# EAGLE design minimote (EAGLE 8.7.1)
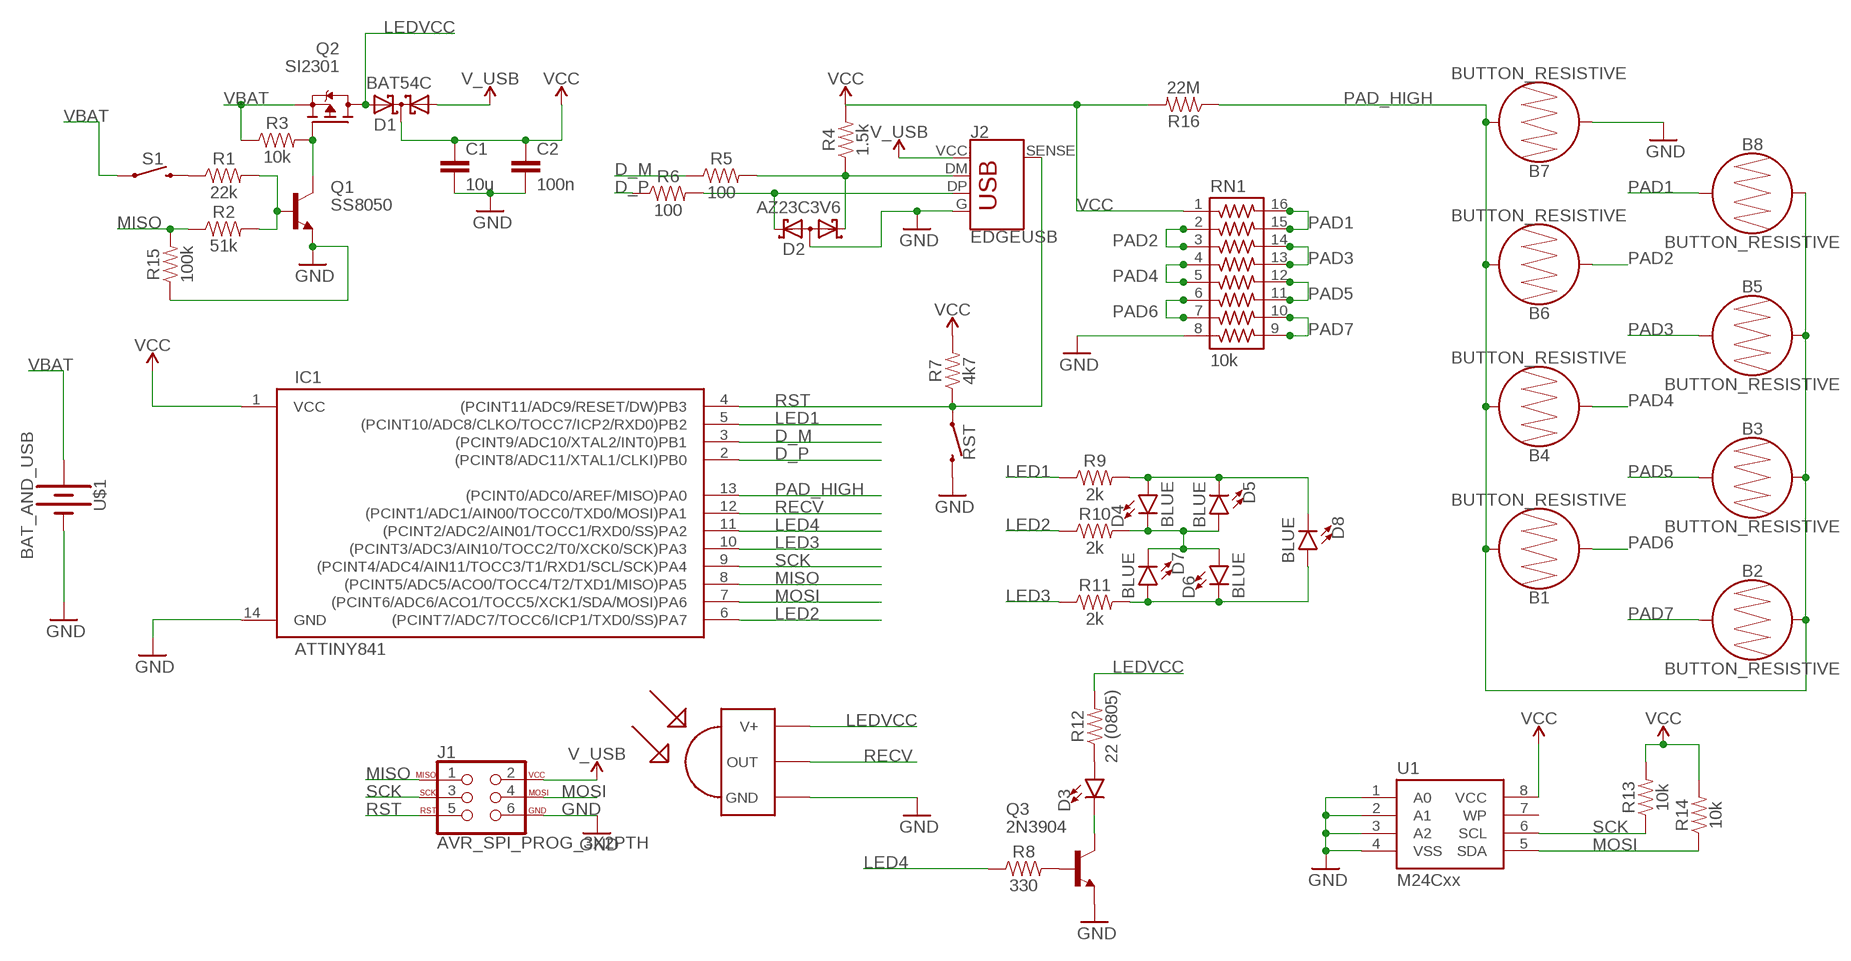
[diagram p0: schematic, sheet 1]

## Parts
B1  BUTTON_RESISTIVE  [BUTTON-CONDUCTIVE]
B2  BUTTON_RESISTIVE  [BUTTON-CONDUCTIVE]
B3  BUTTON_RESISTIVE  [BUTTON-CONDUCTIVE]
B4  BUTTON_RESISTIVE  [BUTTON-CONDUCTIVE]
B5  BUTTON_RESISTIVE  [BUTTON-CONDUCTIVE]
B6  BUTTON_RESISTIVE  [BUTTON-CONDUCTIVE]
B7  BUTTON_RESISTIVE  [BUTTON-CONDUCTIVE]
B8  BUTTON_RESISTIVE  [BUTTON-CONDUCTIVE]
C1  10u  10UF-0603-6.3V-20%  [0603]
C2  100n  10UF-0603-6.3V-20%  [0603]
D1  BAT54C  [SOT23]
D2  AZ23C3V6  [SOT23]
D3  LED3MM  [LED_3MM]
D4  BLUE  LED-BLUE0603  [LED-0603]
D5  BLUE  LED-BLUE0603  [LED-0603]
D6  BLUE  LED-BLUE0603  [LED-0603]
D7  BLUE  LED-BLUE0603  [LED-0603]
D8  BLUE  LED-BLUE0603  [LED-0603]
IC1  ATTINY841  ATTINY441/841-SSU  [SOIC14N]
J1  AVR_SPI_PROG_3X2PTH  [2X3]
J2  EDGEUSB  [USBPCB]
Q1  SS8050  [SOT23]
Q2  SI2301  [SOT23]
Q3  2N3904  MMBT3904LT1-NPN-SOT23-BEC  [SOT23-BEC]
R1  22k  3.3KOHM-0603-1/10W-1%  [0603]
R2  51k  3.3KOHM-0603-1/10W-1%  [0603]
R3  10k  3.3KOHM-0603-1/10W-1%  [0603]
R4  1.5k  3.3KOHM-0603-1/10W-1%  [0603]
R5  100  3.3KOHM-0603-1/10W-1%  [0603]
R6  100  3.3KOHM-0603-1/10W-1%  [0603]
R7  4k7  3.3KOHM-0603-1/10W-1%  [0603]
R8  330  3.3KOHM-0603-1/10W-1%  [0603]
R9  2k  3.3KOHM-0603-1/10W-1%  [0603]
R10  2k  3.3KOHM-0603-1/10W-1%  [0603]
R11  2k  3.3KOHM-0603-1/10W-1%  [0603]
R12  22 (0805)  0.22OHM-0805-1/4W-1%  [0805]
R13  10k  3.3KOHM-0603-1/10W-1%  [0603]
R14  10k  3.3KOHM-0603-1/10W-1%  [0603]
R15  100k  3.3KOHM-0603-1/10W-1%  [0603]
R16  22M  3.3KOHM-0603-1/10W-1%  [0603]
RN1  10k  742-16NS  [742-16NS]
RST  MOMENTARY-SWITCH-SPST-SMD-5.2-REDUNDANT  [TACTILE_SWITCH_SMD_5.2MM]
S1  MOMENTARY-SWITCH-SPST-SMD-5.2-REDUNDANT  [TACTILE_SWITCH_SMD_5.2MM]
U1  M24Cxx  EEPROM-I2CEIAJ  [SO08-EIAJ]
U$1  BAT_AND_USB  [PUNCHOUT_USB]
U$2  TSOP1837  [TSOP18XX]

## Nets
D_M: IC1.3((PCINT9/ADC10/XTAL2/INT0)PB1) R5.1
D_P: IC1.2((PCINT8/ADC11/XTAL1/CLKI)PB0) R6.1
GND: B7.1 C1.2 C2.2 D2.3(AA) IC1.14(GND) J1.6 J2.G(GND) Q1.2(E) Q3.E R15.1 RN1.8 RST.3 RST.4 U1.1(A0) U1.2(A1) U1.3(A2) U1.4(VSS) U$1.B-(-) U$2.GND
LED1: IC1.5((PCINT10/ADC8/CLKO/TOCC7/ICP2/RXD0)PB2) R9.1
LED2: IC1.6((PCINT7/ADC7/TOCC6/ICP1/TXD0/SS)PA7) R10.1
LED3: IC1.10((PCINT3/ADC3/AIN10/TOCC2/T0/XCK0/SCK)PA3) R11.1
LED4: IC1.11((PCINT2/ADC2/AIN01/TOCC1/RXD0/SS)PA2) R8.1
LEDVCC: D1.2(A2) Q2.3(D) R12.2 U$2.VCC(V+)
MISO: IC1.8((PCINT5/ADC5/ACO0/TOCC4/T2/TXD1/MISO)PA5) J1.1 R2.1 R15.2
MOSI: IC1.7((PCINT6/ADC6/ACO1/TOCC5/XCK1/SDA/MOSI)PA6) J1.4 R14.1 U1.5(SDA)
N$1: D3.A R12.1
N$2: D3.K(C) Q3.C
N$3: Q3.B R8.2
N$4: Q1.3(C) Q2.1(G) R3.2
N$6: Q1.1(B) R1.2 R2.2
N$7: R1.1 S1.3 S1.4
N$8: D2.1(K2) J2.DP(D+) R6.2
N$9: D2.2(K1) J2.DM(D-) R4.1 R5.2
N$123: D6.C D7.A D8.A R11.2
N$124: D4.C D5.A D6.A D7.C R10.2
N$125: D4.A D5.C D8.C R9.2
PAD1: B8.1 RN1.15 RN1.16
PAD2: B6.1 RN1.2 RN1.3
PAD3: B5.1 RN1.13 RN1.14
PAD4: B4.1 RN1.4 RN1.5
PAD5: B3.1 RN1.11 RN1.12
PAD6: B1.1 RN1.6 RN1.7
PAD7: B2.1 RN1.9 RN1.10
PAD_HIGH: B1.2 B2.2 B3.2 B4.2 B5.2 B6.2 B7.2 B8.2 IC1.13((PCINT0/ADC0/AREF/MISO)PA0) R16.1
RECV: IC1.12((PCINT1/ADC1/AIN00/TOCC0/TXD0/MOSI)PA1) U$2.OUT
RST: IC1.4((PCINT11/ADC9/RESET/DW)PB3) J1.5 J2.SENSE R7.1 RST.1 RST.2
SCK: IC1.9((PCINT4/ADC4/AIN11/TOCC3/T1/RXD1/SCL/SCK)PA4) J1.3 R13.1 U1.6(SCL)
V_USB: D1.1(A1) J1.2 J2.VCC(VBUS)
VBAT: Q2.2(S) R3.1 S1.1 S1.2 U$1.B+(+)
VCC: C1.1 C2.1 D1.3(CC) IC1.1(VCC) R4.2 R7.2 R13.2 R14.2 R16.2 RN1.1 U1.8(VCC)
Unconnected: U1.7(WP)

## Library data of the parts
B1-B8 = minimote:BUTTON_RESISTIVE
C1 C2 = SparkFun-Capacitors:10UF: 10.0µF ceramic capacitors A capacitor is a passive two-terminal electrical component used to store electrical energy temporarily in an electric field.; PROD_ID: CAP-11015; VALUE: 10uF
D1 = diode:BAT54C: Schottky Diodes Source: Fairchild .. BAT54.pdf
D2 = minimote:AZ23C3V6
D3 = minimote:LED: LED (Generic) Standard schematic elements and footprints for 5mm, 3mm, 1206, and 0603 sized LEDs. Generic LEDs with no color specified.; PROD_ID: DIO-08794
D4-D8 = SparkFun-LED:LED-BLUE: Blue SMD LED Used in manufacturing of various products at SparkFun Packages: 0603 - SMD 0603 package [Product Link] <http://www.digikey.com/product-detail/en/SMLE12BC7TT86/511-1589-2-ND/1641808> 1206 - SMD1206 package [Product Link] <http://www.digikey.com/product-detail/en/lite-on-inc/LTST-C150TBKT/160-1643-1-ND/573584> SparkFun Products: ESP8266 Thing-Dev Board <https://www.sparkfun.com/products/13711> RedBoard <https://www.sparkfun.com/products/12757>; PROD_ID: DIO-08575
IC1 = bt_avr:ATTINY441/841: ATtiny441, ATtiny841 AVR Microcontroller The high-performance Atmel picoPower 8-bit AVR RISC-based microcontroller combines 4KB ISP flash memory, 512-Byte EEPROM, 128B SRAM, 12 general purpose I/O lines, 32 general purpose working registers, an 8-bit timer/counter with two PWM channels, two 16-bit timer/counters with two PWM channels, internal and external interrupts, an 12-channel 10-bit A/D converter, 2 On-chip analog comparators, 2 full duplex USARTs with Start Frame wake up from power down, master/slave SPI serial interface, slave I2C serial interface, programmable gain stage (1x, 20x, and 100x) for 12 differential ADC channel pairs, programmable watchdog timer with internal oscillator, internal calibrated oscillator, and four software selectable power saving modes. The device operates between 1.7-5.5 volts. datasheet.pdf <http://www.atmel.com/Images/Atmel-8495-8-bit-AVR-Microcontrollers-ATtiny441-ATtiny841_Datasheet.pdf>
J1 = minimote:AVR_SPI_PROG_3X2: AVR ISP 6 Pin This is the reduced ISP connector for AVR programming. Common on Arduino. This footprint will take up less PCB space and can be used with a 10-pin to 6-pin adapter such as SKU: BOB-08508 **Special note about "TEST_POINT" package. The stop mask is on the top side, so if you want your programming test points to be on the bottom of your board, make sure to place this package on the bottom side of the board. This also ensure that the orientation to program from the bottom side will be correct. SparkFun Products: SparkFun ISP Pogo Adapter <https://www.sparkfun.com/products/11591> - NS Tiny AVR Programmer <https://www.sparkfun.com/products/11801> -PTH
J2 = minimote:EDGEUSB
Q1 = minimote:SS8050
Q2 = minimote:SI2301
Q3 = transistor:*-NPN-: NPN Transistror BF959 corrected 2008.03.06
R1-R11 R13-R16 = SparkFun-Resistors:3.3KOHM: 3.3kΩ resistor A resistor is a passive two-terminal electrical component that implements electrical resistance as a circuit element. Resistors act to reduce current flow, and, at the same time, act to lower voltage levels within circuits. - Wikipedia; PROD_ID: RES-07851; VALUE: 3.3k
R12 = SparkFun-Resistors:0.22OHM: 0.22Ω resistor A resistor is a passive two-terminal electrical component that implements electrical resistance as a circuit element. Resistors act to reduce current flow, and, at the same time, act to lower voltage levels within circuits. - Wikipedia; PROD_ID: RES-09883; VALUE: 0.22
RN1 = resistor-array:742-16: CTS 742 Series 16 Terminations, 8 Resistors
RST S1 = SparkFun-Switches:MOMENTARY-SWITCH-SPST: Momentary Switch (Pushbutton) - SPST Normally-open (NO) SPST momentary switches (buttons, pushbuttons). Variants PTH-12MM - 12mm square, through-hole Momentary Pushbutton Switch - 12mm Square <https://www.sparkfun.com/products/9190> (COM-09190) PTH-6.0MM, PTH-6.0MM-KIT - 6.0mm square, through-hole Mini Pushbutton Switch <https://www.sparkfun.com/products/97> (COM-00097) KIT package intended for soldering kit's - only one side of pads' copper is exposed. PTH-RIGHT-ANGLE-KIT - Right-angle, through-hole Right Angle Tactile Button <https://www.sparkfun.com/products/10791> - Used on SparkFun BigTime Watch Kit <https://www.sparkfun.com/products/11734> SMD-12MM - 12mm square, surface-mount Tactile Button - SMD (12mm) <https://www.sparkfun.com/products/12993> (COM-12993) Used on SparkFun PicoBoard <https://www.sparkfun.com/products/11888> SMD-4.5MM - 4.5mm Square Trackball Switch Used on SparkFun Blackberry Trackballer Breakout <https://www.sparkfun.com/products/13169> SMD-4.6MMX2.8MM - 4.60mm x 2.80mm, surface mount Used on SparkFun SAMD21 Mini Breakout <https://www.sparkfun.com/products/13664> SMD-5.2MM, SMD-5.2-REDUNDANT - 5.2mm square, surface-mount Mini Pushbutton Switch - SMD <https://www.sparkfun.com/products/8720> (COM-08720) Used on Arduino Pro Mini <https://www.sparkfun.com/products/11114> REDUNDANT package connects both switch circuits together SMD-6.0X3.5MM - 6.0 x 3.5mm, surface mount Momentary Reset Switch SMD <https://www.sparkfun.com/products/8229> (COM-08229) SMD-6.2MM-TALL - 6.2mm square, surface mount Tactile Button - SMD (6mm) <https://www.sparkfun.com/products/12992> Used on SparkFun Digital Sandbox <https://www.sparkfun.com/products/12651> SMD-RIGHT-ANGLE - Right-angle, surface mount Used on SparkFun Block for Intel® Edison - Arduino <https://www.sparkfun.com/products/13036>; PROD_ID: SWCH-08247; SF_SKU: COM-08720
U1 = SparkFun-IC-Memory:EEPROM-I2C: I2C EEPROMs, 24LC256 and others 24LC256 Series 256 kb I2C 2 Wire (32 k x 8 Bit) 2.5 V Serial EEPROM SMD - SOIC-8 Datasheet SparkFun Products SparkFun UDB5 - PIC UAV Development Board <https://www.sparkfun.com/products/11703> (GPS-11703); PROD_ID: NA-XXXXX; VALUE: I2C EEPROM
U$1 = minimote:BAT_AND_USB
U$2 = tsop:TSOP1837: IR Receiver and Demodulator

## Board
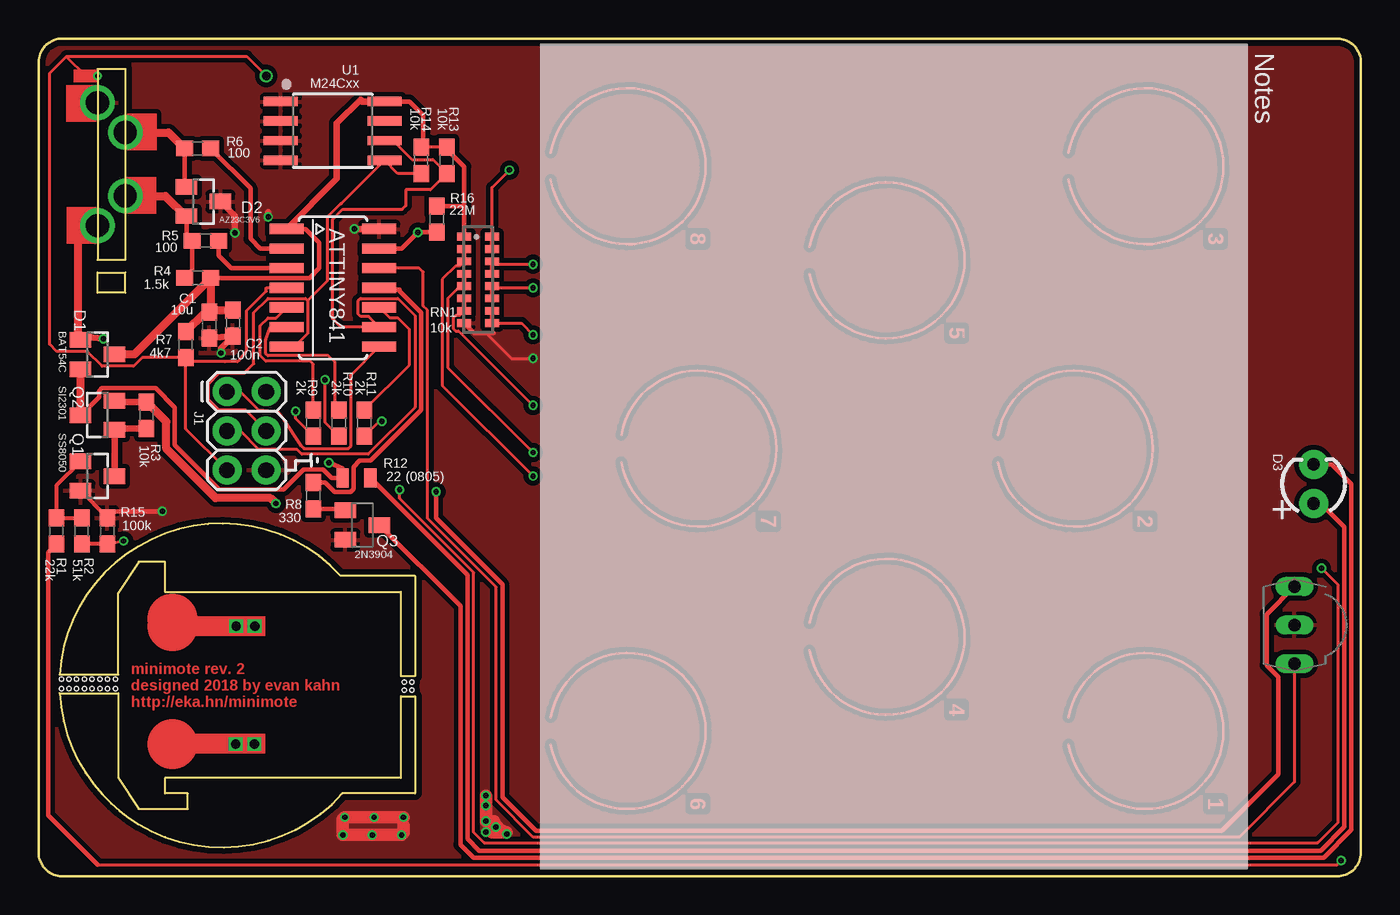
[diagram p1: board, top side]
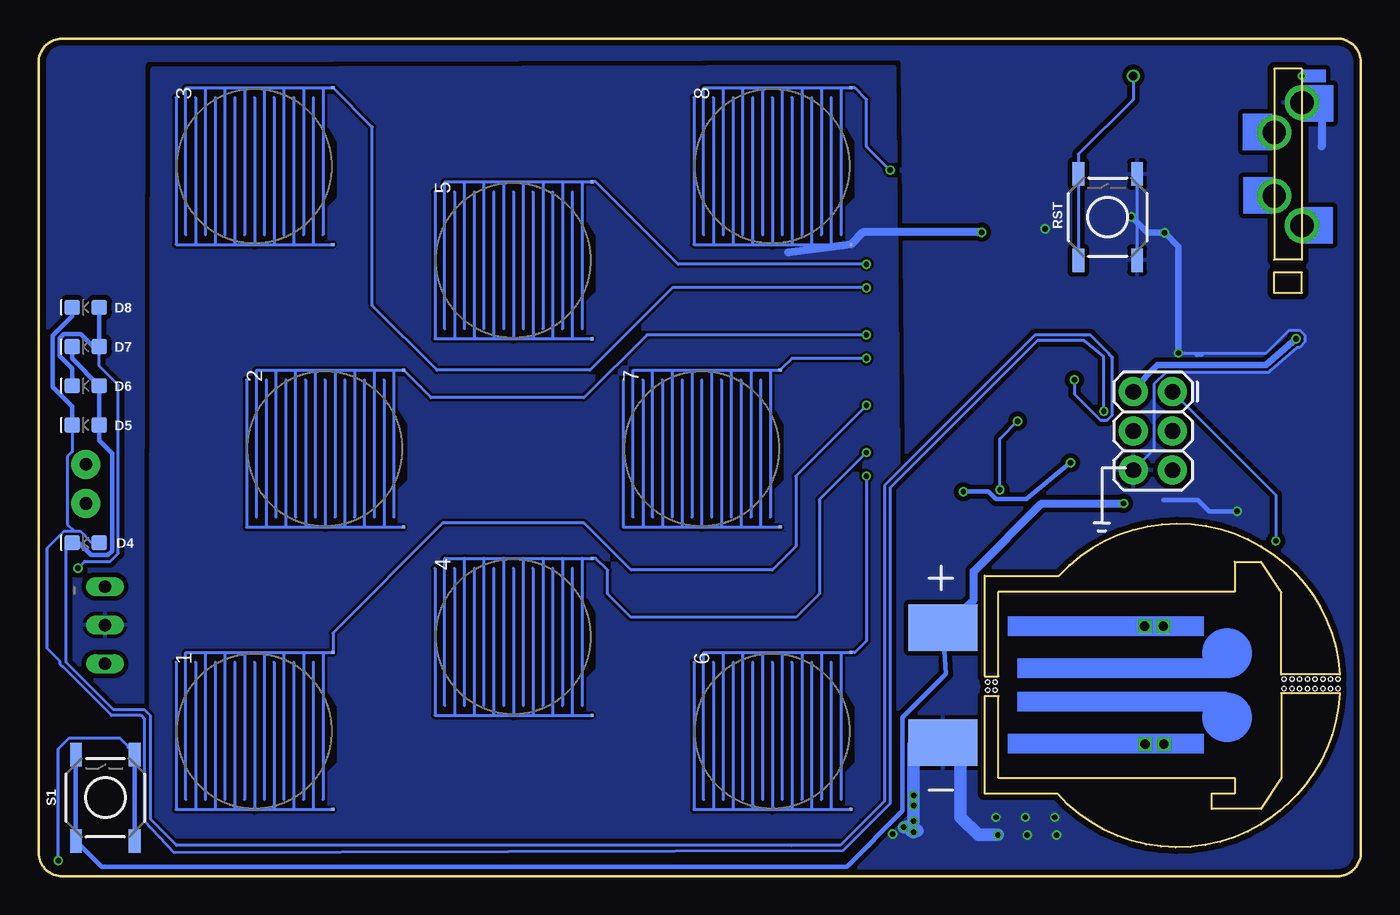
[diagram p2: board, bottom side, seen from below]

Size 85.61 x 54.24 mm. Coordinates in mm from the lower left corner, seen from the top.
Outline: 84.21,0.01 1.66,0.01 arc-90 0.01,1.4 0.01,52.58 arc-90 1.4,54.23 83.95,54.23 arc-90 85.6,52.84 85.6,1.66 arc-90 84.21,0.01
Copper layers (1*16): Top 0.035559375mm / dielectric 1.6mm / Bottom 0.035559375mm
Design rules "oshpark-2layer": minimum track width 6mil, minimum drill 10mil, track to track 6mil, track to pad 6mil, pad to pad 6mil, via to via 6mil, smd to smd 6mil, copper to edge 15mil, drill to drill 6mil, minimum pad ring 5mil, minimum via ring 5mil, stop-mask expansion 2.5mil, vias tented up to drill 0mil, thermal gap 10mil

### Footprints (pad centres in the part's own frame; a part is rotated, then mirrored left to right if it is on the bottom)
BUTTON-CONDUCTIVE = smd 0.203 x 0.203: 1 5.08,3.81; 2 5.08,-6.35
0603 = smd 1.1 x 1: 1 -0.85,0; 2 0.85,0
SOT23 = smd 1 x 1.4: 1 -0.95,-1.1; 2 0.95,-1.1; 3 0,1.1
LED_3MM = drill 0.813 pad 1.88: A -1.27,0; K 1.27,0
LED-0603 = smd 1 x 1: A -0.877,0; C 0.877,0
SOIC14N = smd 0.66 x 2.2: 1 -3.81,-3; 2 -2.54,-3; 3 -1.27,-3; 4 0,-3; 5 1.27,-3; 6 2.54,-3; 7 3.81,-3; 8 3.81,3; 9 2.54,3; 10 1.27,3; 11 0,3; 12 -1.27,3; 13 -2.54,3; 14 -3.81,3
2X3 = drill 1.016 pad 1.88: 1 0,0; 2 0,2.54; 3 2.54,0; 4 2.54,2.54; 5 5.08,0; 6 5.08,2.54
USBPCB = drill 1.5: DM 2.053,1.8; DP -2.053,1.8; G -3.982,0; VCC 3.982,0 | drill 0.3: SENSE -5.715,0
SOT23-BEC = smd 1 x 1.4: B -0.95,-1.1; C 0,1.1; E 0.95,-1.1
0805 = smd 0.8 x 1.2: 1 -0.9,0; 2 0.9,0
742-16NS = smd 0.5 x 0.9: 1 -2.8,-0.9; 2 -2,-0.9; 3 -1.2,-0.9; 4 -0.4,-0.9; 5 0.4,-0.9; 6 1.2,-0.9; 7 2,-0.9; 8 2.8,-0.9; 9 2.8,0.9; 10 2,0.9; 11 1.2,0.9; 12 0.4,0.9; 13 -0.4,0.9; 14 -1.2,0.9; 15 -2,0.9; 16 -2.8,0.9
TACTILE_SWITCH_SMD_5.2MM = smd 1.524 x 0.762: 1 -2.794,1.905; 2 2.794,1.905; 3 -2.794,-1.905; 4 2.794,-1.905
SO08-EIAJ = smd 0.61 x 2.21: 1 -1.905,-3.378; 2 -0.635,-3.378; 3 0.635,-3.378; 4 1.905,-3.378; 5 1.905,3.353; 6 0.635,3.353; 7 -0.635,3.353; 8 -1.905,3.353
PUNCHOUT_USB = smd 3 x 4.45: B+ 9.75,16.9; B- 2.3,16.9 | drill 0.6 square: P$2 2.2,2.6; P$4 9.836,2.627; P$5 2.2,3.807; P$6 9.836,3.833 | hole 0.254: 5.7,14; 5.7,13.5; 6.2,14; 6.2,13.5; 5.8,-5.2; 5.8,-6.2; 6.4,-5.7; 5.8,-5.7; 6.4,-5.2; 6.4,-6.2; 5.8,-6.7; 6.4,-6.7; 5.8,-7.2; 6.4,-7.2; 6.4,-7.7; 5.8,-7.7; 5.8,-8.2; 6.4,-8.2; 5.8,-8.7; 6.4,-8.7
TSOP18XX = drill 0.813 pad 1.143 long: GND -0.001,-0.027; OUT -2.501,-0.027; VCC 2.499,-0.027

### Placement (x,y rotation side)
B1  71.63,10.67 0 bottom
B2  67.06,28.96 0 bottom
B3  71.63,47.25 0 bottom
B4  54.87,16.77 0 bottom
B5  54.87,41.15 0 bottom
B6  38.11,10.67 0 bottom
B7  42.68,28.96 0 bottom
B8  38.11,47.25 0 bottom
C1  11.05,35.69 270 top
C2  12.58,35.82 270 top
D1  3.82,33.79 270 top
D2  10.67,43.69 270 top
D3  82.56,25.41 90 top
D4  82.56,21.6 180 bottom
D5  82.56,29.22 180 bottom
D6  82.56,31.76 180 bottom
D7  82.56,34.3 180 bottom
D8  82.56,36.84 180 bottom
IC1  19.06,38.11 270 top
J1  12.2,31.37 270 top
J2  3.82,46.11 270 top
Q1  3.82,25.91 270 top
Q2  3.82,29.85 90 top
Q3  20.96,22.74 270 top
R1  1.15,22.36 90 top
R2  2.8,22.36 90 top
R3  6.99,29.85 270 top
R4  10.29,38.74 0 top
R5  10.8,41.15 180 top
R6  10.29,47.12 180 top
R7  9.53,34.42 90 top
R8  17.79,24.64 270 top
R9  17.79,29.34 270 top
R10  19.44,29.34 270 top
R11  21.09,29.34 270 top
R12  20.58,25.79 180 top
R13  26.42,46.36 90 top
R14  24.77,46.36 90 top
R15  4.45,22.36 270 top
R16  25.79,42.55 90 top
RN1  28.45,38.61 270 top
RST  16.39,42.68 90 bottom
S1  81.29,5.09 90 bottom
U1  19.06,48.27 270 top
U$1  10.17,6.36 90 bottom
U$2  81.29,16.26 90 top

### Tracks (layer width: path | path; a pad name or v marks a point on that pad's centre or on a via)
D_M
  Top 0.305: IC1.3 12.45,39.38 11.65,40.18 R5.1
D_P
  Top 0.305: R6.1 13.72,44.54 13.72,41.28 14.36,40.65 IC1.2
GND  (via drill 0.35)
  Top 0.203: 28.96,35.18 30.61,33.53 v32.01,33.53
  Top 0.254: R15.1 4.45,23.23 Q1.2
  Top 0.305: RN1.8 28.18,35.18 28.96,35.18 29.47,35.18 | v8.01,23.63 4.85,23.63 4.45,23.23
  Top 0.406: C1.2 C2.2 11.82,34.21 v11.82,33.87 | IC1.14 v20.45,41.92 | 14.86,43.01 v14.86,42.7 | D2.3 12.71,42.76 v12.71,41.66
  Top 0.813: v23.63,3.82 v21.72,3.82 v19.82,3.82 19.69,3.69 v19.69,2.67 v21.6,2.67 v23.5,2.67 23.63,2.8 23.63,3.31 | v28.96,5.21 v28.96,4.58 v28.96,3.56 29.47,3.56 v29.6,3.18 | v29.6,3.18 30.2,2.83 | 30.2,2.83 30.31,2.83 | 30.2,2.83 29.37,2.83 29.73,3.19 v29.6,3.18
  Bottom 0.203: v32.01,33.53 36.84,33.53 B7.1 | RST.3 RST.4 | J1.6 13.39,27.64 13.39,31.87 12.63,32.63 5.98,32.63 5.84,32.77 4.14,34.25 3.97,34.25 3.64,34.57 3.64,35.03 3.97,35.36 4.65,35.36 6.13,33.87 v11.82,33.87
  Bottom 0.305: v8.01,23.63 9.82,23.63 10.55,24.36 12.8,24.36 | 10.63,33.75 10.29,33.79
  Bottom 0.406: v14.86,42.7 13.83,41.66 v12.71,41.66 11.82,40.77 v11.82,33.87
  Bottom 0.508: J2.G 2.85,50.09 2.55,49.79 2.55,47.25
  Bottom 0.813: v23.5,2.67 24.77,2.67 25.91,3.82 25.91,7.7 U$1.B- 27.01,8.51 28.96,8.51 v28.96,3.56 | v29.6,3.18 29.09,3.31 28.71,2.93 29.14,2.93 v28.96,2.86
  other vias: 30.31,2.73
  pour Top (isolate 0.305, rank 2): -22.85,60.97 -22.85,-1.26 -11.68,-17.01 95,-17.01 99.07,-6.34 104.15,-1.26 104.15,67.32
  pour Bottom (isolate 0.305, rank 2): -8.88,60.97 -25.39,3.82 -12.69,-15.23 76.21,-19.04 92.72,-2.53 92.72,62.24 -3.8,62.24 -10.15,68.59
LED1
  Top 0.203: R9.1 17.79,33.15 17.58,33.36 14.7,33.36 14.35,33.71 14.35,34.65 14.32,34.71 14.35,34.79 14.35,35.65 14.85,36.15 15.37,36.15 IC1.5
LED2
  Top 0.203: R10.1 19.18,30.45 19.18,33.28 18.75,33.71 14.85,33.71 14.7,33.86 14.7,34.73 14.98,35.51 15.19,35.51 16.9,35.57 IC1.6
LED3
  Top 0.203: R11.1 24.01,33.11 24.01,35.4 23.26,36.15 22.74,36.15 IC1.10
LED4
  Top 0.305: R8.1 18.54,25.49 19.15,24.88 20.21,24.88 20.38,25.06 20.38,26.51 20.8,26.93 21.51,26.93 24.77,30.19 24.77,36.48 23.37,37.88 23.37,37.98 22.18,37.98 IC1.11
LEDVCC  (via drill 0.35)
  Top 0.305: Q2.3 3.91,31.05 3.91,31.43 4.09,31.61 7.57,31.61 8.82,30.35 8.82,27.91 11.68,25.05 15.86,25.05 17.16,26.35 18.41,26.35 18.97,25.79 R12.2 19.68,26.41 v18.8,26.78 | v25.73,24.9 25.73,23.19 30.03,18.89 30.03,5.1 32.2,2.93 76.59,2.93 80.27,6.61 80.27,12.9 79.51,13.66 79.51,16.96 U$2.VCC
  Top 0.508: Q2.3 D1.2
  Bottom 0.305: v25.73,24.9 24.1,24.9 23.62,24.42 21.67,24.42 v18.8,26.78
MISO  (via drill 0.35)
  Top 0.203: IC1.8 20.19,32.43 20.19,27.84 20.04,27.69 17.18,27.69 17.03,27.84 15.89,29.54 15.5,30.05 14.24,30.18 13.05,31.37 J1.1 | v5.5,21.71 5.3,21.63 R15.2
  Top 0.254: R15.2 R2.1
  Bottom 0.203: 5.5,24.55 v5.5,21.71 5.5,24.68 J1.1
MOSI
  Top 0.203: 17.41,37.27 17.26,37.42 14.85,37.42 13.93,36.5 13.93,33.19 13.31,32.57 11.7,32.57 11,31.87 11,30.88 11.7,30.18 13.39,30.18 J1.4 | IC1.7 16.57,34.3 17.41,35.13 17.41,37.27 | 17.41,37.27 18.67,38.54 18.67,42.67 19.54,43.54 19.59,43.54 U1.5 23.26,45.51 R14.1
N$1
  Top 0.305: R12.1 27.77,19.5 27.77,2.42 28.53,1.65 83,1.65 84.54,3.19 84.54,22.61 83.01,24.14 D3.A
N$2
  Top 0.305: Q3.C 27.31,17.49 27.31,2.04 28.15,1.2 83.19,1.2 84.99,3 84.99,25.41 83.72,26.68 D3.K
N$3
  Top 0.305: Q3.B 19.76,23.79 R8.2
N$4
  Top 0.406: R3.2 5.02,29 Q2.1 Q1.3
N$6
  Top 0.254: R2.2 R1.2 1.15,25.3 Q1.1
N$7  (via drill 0.35)
  Top 0.203: v84.33,1.02 84.05,0.74 3.82,0.74
  Top 0.305: 3.82,0.74 0.62,3.94 0.62,20.97 R1.1
  Bottom 0.203: S1.4 79.84,8.34 79.84,8.45 80.34,8.96 83.62,8.96 84.33,8.24 v84.33,1.02
  Bottom 0.305: S1.4 S1.3
N$8
  Top 0.305: R6.2 9.44,44.77 D2.1
  Top 0.508: J2.DP 8.41,48.16 R6.2
N$9
  Top 0.305: D2.2 9.57,42.68 9.57,41.28 R5.2 9.95,39.25 R4.1
  Top 0.508: J2.DM 8.2,44.05 9.57,42.68
N$123  (via drill 0.35)
  Top 0.203: R11.2 22.06,29.47 v22.23,29.47 | v83.06,19.94 84.13,18.88 84.13,3.49 82.82,2.17 28.84,2.17 28.17,2.84 28.17,19.67 23.37,24.47 v23.37,25.02
  Bottom 0.203: v22.23,29.47 23.37,28.33 v23.37,25.02 | D7.A 81.68,33.03 80.45,31.8 80.45,20.91 80.97,20.38 82.62,20.38 v83.06,19.94
  Bottom 0.305: D6.C 83.43,32.86 84.24,33.67 84.24,34.83 83.97,35.1 82.89,35.1 82.09,34.3 D7.A D8.A
N$124  (via drill 0.35)
  Top 0.203: R10.2 18.55,29.38 v18.55,32.14
  Bottom 0.203: v18.55,32.14 18.55,31.22 16.87,29.55 16.41,29.55 16.09,29.87 16.09,33.61 16.3,33.82 16.31,33.85 16.4,33.93 17.51,35.03 17.79,35.03 17.81,35.05 17.93,35.03 21.11,35.03 30.84,25.3 30.84,4.85 33.68,2.01 36.84,2 76.68,2 78.36,3.69 78.36,10.39 78.75,10.78 80.75,10.78 83.83,13.85 83.83,21.2 D4.C
  Bottom 0.305: D4.C 83.02,21.6 82.22,20.79 81.14,20.79 80.85,21.08 80.85,27.38 81.68,28.21 D5.A D6.A 83.43,33.51 D7.C
N$125  (via drill 0.35)
  Top 0.203: R9.2 16.64,29.64 v16.64,30.1
  Bottom 0.203: v16.64,30.1 16.64,33.66 17.91,34.68 20.96,34.68 30.49,25.15 30.49,4.7 33.53,1.66 76.84,1.53 78.75,3.56 78.75,10.17 78.98,10.4 80.88,10.4 84.06,13.58 84.16,13.65 84.16,13.68 84.21,13.73 84.21,13.9 85.04,14.74 85.04,21.25 83.95,22.35 83.32,22.35 | 83.32,22.35 82.92,22.35 82.16,21.6 D4.A | D5.C 83.43,27.49 83.75,27.17 83.75,22.78 83.32,22.35
  Bottom 0.305: D5.C 83.43,30.41 84.69,31.67 84.69,35.02 83.43,36.29 D8.C
PAD1  (via drill 0.35)
  Top 0.203: RN1.16 29.35,44.59 v30.49,45.73
  Top 0.305: RN1.16 RN1.15
  Bottom 0.203: v30.49,45.73 32.01,47.25 32.01,50.3 32.77,51.06 B8.1
PAD2  (via drill 0.35)
  Top 0.203: RN1.3 27.26,39.52 27,39.52 26.14,38.66 26.14,31.78 v32.01,25.91
  Top 0.305: RN1.2 RN1.3
  Bottom 0.203: v32.01,25.91 32.01,15.25 32.77,14.48 B6.1
PAD3  (via drill 0.35)
  Top 0.203: RN1.14 29.54,39.63 v32.01,39.63
  Top 0.305: RN1.13 RN1.14
  Bottom 0.203: v32.01,39.63 44.2,39.63 49.54,44.96 B5.1
PAD4  (via drill 0.35)
  Top 0.203: RN1.4 27.55,38.47 26.49,37.41 26.49,32.95 v32.01,27.44
  Top 0.305: RN1.4 RN1.5
  Bottom 0.203: v32.01,27.44 35.06,24.39 35.06,18.29 36.58,16.77 47.25,16.77 48.77,18.29 48.77,19.82 49.54,20.58 B4.1
PAD5  (via drill 0.35)
  Top 0.203: RN1.12 29.46,38.11 v32.01,38.11
  Top 0.305: RN1.12 RN1.11
  Bottom 0.203: v32.01,38.11 44.58,38.11 49.92,32.77 59.82,32.77 64.01,36.96 64.01,48.52 B3.1
PAD6  (via drill 0.35)
  Top 0.203: RN1.7 27.26,36.32 27,36.32 26.85,36.17 26.85,35.46 27,35.31 27.19,35.31 v32.01,30.49
  Top 0.305: RN1.6 RN1.7
  Bottom 0.203: v32.01,30.49 36.58,25.91 36.58,21.34 38.11,19.82 47.25,19.82 50.3,22.87 59.44,22.87 66.55,15.75 B1.1
PAD7  (via drill 0.35)
  Top 0.203: RN1.9 31.25,35.81 v32.01,35.06
  Top 0.305: RN1.9 RN1.10
  Bottom 0.203: v32.01,35.06 46.23,35.06 50.3,30.99 60.2,30.99 B2.1
PAD_HIGH  (via drill 0.35)
  Top 0.305: IC1.13 23.5,40.65 v24.56,41.7 R16.1
  Bottom 0.203: 25.66,41.7 24.77,41.7
  Bottom 0.508: 24.77,41.7 v24.56,41.7 32.22,41.7 B8.2 37.09,40.39
  pour Bottom: 30.36,52.33 29.85,2.67 78.24,2.67 78.11,52.2
RECV
  Top 0.203: IC1.12 24.64,39.38 24.9,39.12 24.9,36.93 25.18,36.65 25.18,23.17 29.62,18.72 29.62,4.93 32.03,2.53 77.74,2.53 81.31,6.1 U$2.OUT
RST  (via drill 0.55)
  Top 0.203: 9.4,33.57 R7.1 9.53,28.96 J1.5 | 9.4,33.57 6.69,33.57 6.15,33.03 4.11,33.03 3.16,33.98 1.18,33.98 0.72,34.45 0.72,49.08 0.72,52 1.8,53.08 | 1.8,53.08 1.81,53.09 13.47,53.09 v14.74,51.82 | 12.87,33.32 12.9,33.34 | 12.9,33.34 12.96,33.41 13.47,34.04 13.47,36.61 14.74,37.88 14.74,38.11 IC1.4 | 12.9,33.34 12.07,33.34 12.05,33.32 9.66,33.32 9.4,33.57 | 1.8,53.08 3.05,51.82 J2.SENSE
  Bottom 0.203: RST.1 RST.2 18.29,46.74 14.74,50.3 v14.74,51.82 | J2.SENSE 3.05,51.82
SCK
  Top 0.203: U1.6 22.94,47.63 24.17,46.41 25.53,46.41 R13.1 25.37,44.46 23.77,44.46 23.77,43.41 23.54,43.19 19.69,43.19 19.03,42.53 19.03,36.1 19.56,35.57 IC1.9 21.37,36.25 20.85,36.25 20.7,36.4 20.7,37.27 20.85,37.42 23.26,37.42 24.36,36.32 24.36,30.36 21.34,27.33 17.03,27.33 16.73,27.64 14.24,27.64 13.07,28.82 13.05,28.83 J1.3
V_USB  (via drill 0.35)
  Top 0.406: 2.65,34.68 D1.1 | v4.2,34.8 2.81,34.93 2.67,34.79
  Top 0.508: D1.1 2.67,34.79 2.55,34.91 2.55,41.15 3.52,42.12 J2.VCC
  Bottom 0.406: v4.2,34.8 6.15,33.1 13.16,33.1 14.74,31.53 J1.2
VBAT  (via drill 0.35)
  Top 0.406: Q2.2 5.02,30.7 R3.1
  Top 0.508: v15.37,24.14 15.02,24.49 11.45,24.49 8.26,27.68 8.26,29.43 R3.1
  Bottom 0.305: S1.2 S1.1 81.51,0.62 77.22,0.62 33.28,0.62 29.67,4.22 29.67,10.28 26.87,13.09 U$1.B+
  Bottom 0.508: U$1.B+ 25.06,17.91 25.06,19.74 20.67,24.14 v15.37,24.14
VCC
  Top 0.203: R13.2 26.29,47.21 24.9,47.21 R14.2 24.39,47.59 24.39,47.63
  Top 0.305: R4.2 17.53,38.74 18.17,39.38 18.17,41.03 17.28,41.92 IC1.1 | RN1.1 27.55,43.44 | 27.55,43.44 27.55,45.95 26.29,47.21 | R16.2 27.51,43.4 27.55,43.44 | U1.8 24.01,50.17 24.9,49.28 24.9,47.21
  Top 0.406: IC1.1 19.31,45.17 19.31,48.77 20.83,50.3 20.96,50.17 U1.8
  Top 0.508: D1.3 6.19,33.79 R4.2 11.14,36.63 C1.1 | R7.2 10.8,36.54 C1.1 | C1.1 11.18,36.67 C2.1

### Text on the board
Top: 8 | 3 | 5 | 7 | 2 | minimote rev. 2 / designed 2018 by evan kahn / http://eka.hn/minimote | 4 | 6 | 1
tPlace: Notes
bPlace: 8 | 3 | 5 | 7 | 2 | 4 | 6 | 1
tNames: +
tStop: minimote rev. 2 / designed 2018 by evan kahn / http://eka.hn/minimote